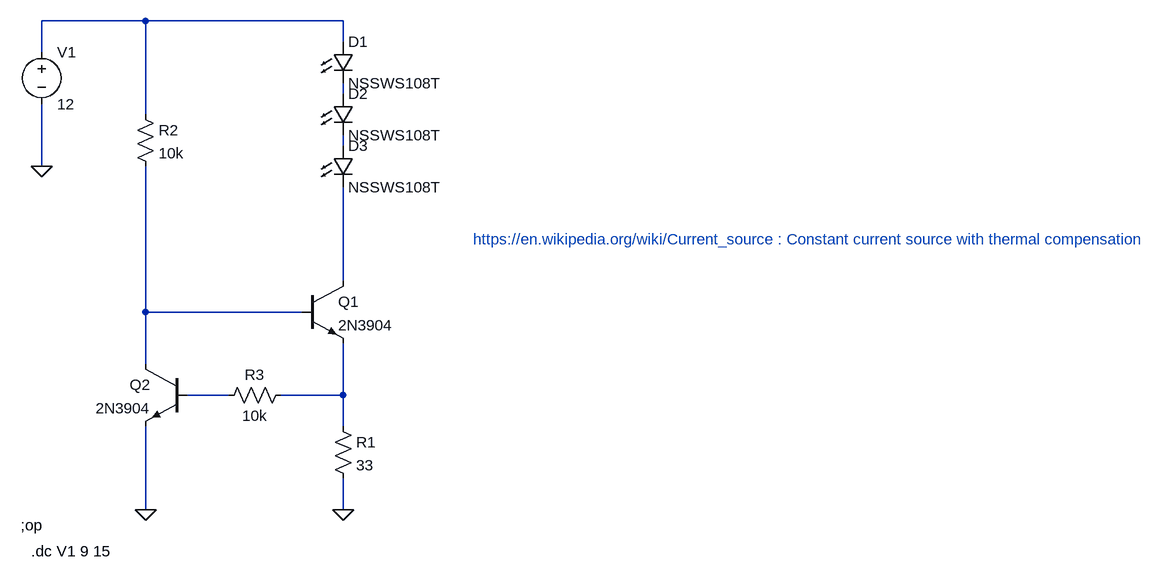
[diagram p0: schematic discrete.asc]
discrete.asc, the LTspice schematic file:
Version 4
SHEET 1 1740 864
WIRE 64 32 -96 32
WIRE 368 32 64 32
WIRE 368 64 368 32
WIRE -96 80 -96 32
WIRE 368 144 368 128
WIRE 64 176 64 32
WIRE 368 224 368 208
WIRE -96 256 -96 160
WIRE 368 432 368 288
WIRE 64 480 64 256
WIRE 304 480 64 480
WIRE 64 560 64 480
WIRE 192 608 128 608
WIRE 368 608 368 528
WIRE 368 608 272 608
WIRE 368 656 368 608
WIRE 64 784 64 656
WIRE 368 784 368 736
FLAG 368 784 0
FLAG 64 784 0
FLAG -96 256 0
SYMBOL LED 352 64 R0
SYMATTR InstName D1
SYMATTR Value NSSWS108T
SYMATTR Description Diode
SYMATTR Type diode
SYMBOL npn 304 432 R0
SYMATTR InstName Q1
SYMATTR Value 2N3904
SYMBOL npn 128 560 M0
SYMATTR InstName Q2
SYMATTR Value 2N3904
SYMBOL res 352 640 R0
SYMATTR InstName R1
SYMATTR Value 33
SYMBOL res 48 160 R0
SYMATTR InstName R2
SYMATTR Value 10k
SYMBOL voltage -96 64 R0
SYMATTR InstName V1
SYMATTR Value 12
SYMBOL LED 352 144 R0
SYMATTR InstName D2
SYMATTR Value NSSWS108T
SYMATTR Description Diode
SYMATTR Type diode
SYMBOL LED 352 224 R0
SYMATTR InstName D3
SYMATTR Value NSSWS108T
SYMATTR Description Diode
SYMATTR Type diode
SYMBOL res 288 592 R90
WINDOW 0 0 56 VBottom 2
WINDOW 3 32 56 VTop 2
SYMATTR InstName R3
SYMATTR Value 10k
TEXT -128 808 Left 2 !;op
TEXT -112 848 Left 2 !.dc V1 9 15
TEXT 568 368 Left 2 ;https://en.wikipedia.org/wiki/Current_source : Constant current source with thermal compensation

The netlist it stands for:
* discrete.asc
D1 N001 N002 NSSWS108T
Q1 N004 N005 N007 0 2N3904
Q2 N005 N006 0 0 2N3904
R1 N007 0 33
R2 N001 N005 10k
V1 N001 0 12
D2 N002 N003 NSSWS108T
D3 N003 N004 NSSWS108T
R3 N007 N006 10k
.model D D
.lib standard.dio
.model NPN NPN
.model PNP PNP
.lib standard.bjt
;op
.dc V1 9 15
* https://en.wikipedia.org/wiki/Current_source : Constant current source with thermal compensation
.backanno
.end